# EAGLE design riffle-proto-grove-1.3 (EAGLE 7.5.0)
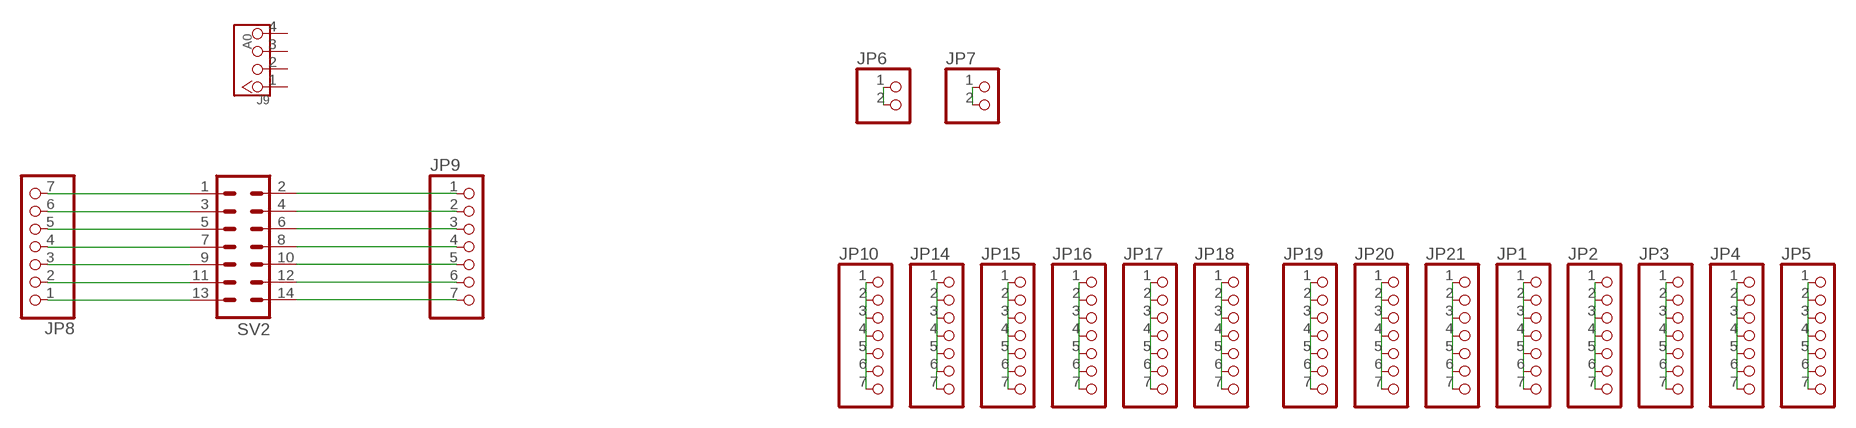
[diagram p0: schematic, sheet 1]

## Parts
J9  A0  TWIG-4P-2.0'90D'  [4P-2.0-90D]
JP1  HEADER-1X770MIL  [1X07_ROUND_70]
JP2  HEADER-1X770MIL  [1X07_ROUND_70]
JP3  HEADER-1X770MIL  [1X07_ROUND_70]
JP4  HEADER-1X770MIL  [1X07_ROUND_70]
JP5  HEADER-1X770MIL  [1X07_ROUND_70]
JP6  HEADER-1X2ROUND  [1X02_ROUND]
JP7  HEADER-1X2ROUND  [1X02_ROUND]
JP8  HEADER-1X770MIL  [1X07_ROUND_70]
JP9  HEADER-1X770MIL  [1X07_ROUND_70]
JP10  HEADER-1X770MIL  [1X07_ROUND_70]
JP14  HEADER-1X770MIL  [1X07_ROUND_70]
JP15  HEADER-1X770MIL  [1X07_ROUND_70]
JP16  HEADER-1X770MIL  [1X07_ROUND_70]
JP17  HEADER-1X770MIL  [1X07_ROUND_70]
JP18  HEADER-1X770MIL  [1X07_ROUND_70]
JP19  HEADER-1X770MIL  [1X07_ROUND_70]
JP20  HEADER-1X770MIL  [1X07_ROUND_70]
JP21  HEADER-1X770MIL  [1X07_ROUND_70]
SV2  MA07-2  [MA07-2]

## Nets
D3: JP9.5 SV2.10
GND: JP9.7 SV2.14
N$1: JP8.1 SV2.13
N$2: JP8.2 SV2.11
N$3: JP8.3 SV2.9
N$4: JP8.4 SV2.7
N$5: JP8.5 SV2.5
N$6: JP8.6 SV2.3
N$7: JP8.7 SV2.1
N$8: JP10.1 JP10.2 JP10.3 JP10.4 JP10.5 JP10.6 JP10.7
N$9: JP14.1 JP14.2 JP14.3 JP14.4 JP14.5 JP14.6 JP14.7
N$10: JP9.3 SV2.6
N$11: JP9.4 SV2.8
N$12: JP15.1 JP15.2 JP15.3 JP15.4 JP15.5 JP15.6 JP15.7
N$13: JP16.1 JP16.2 JP16.3 JP16.4 JP16.5 JP16.6 JP16.7
N$14: JP17.1 JP17.2 JP17.3 JP17.4 JP17.5 JP17.6 JP17.7
N$15: JP18.1 JP18.2 JP18.3 JP18.4 JP18.5 JP18.6 JP18.7
N$16: JP19.1 JP19.2 JP19.3 JP19.4 JP19.5 JP19.6 JP19.7
N$17: JP20.1 JP20.2 JP20.3 JP20.4 JP20.5 JP20.6 JP20.7
N$18: JP21.1 JP21.2 JP21.3 JP21.4 JP21.5 JP21.6 JP21.7
N$19: JP1.1 JP1.2 JP1.3 JP1.4 JP1.5 JP1.6 JP1.7
N$20: JP2.1 JP2.2 JP2.3 JP2.4 JP2.5 JP2.6 JP2.7
N$21: JP3.1 JP3.2 JP3.3 JP3.4 JP3.5 JP3.6 JP3.7
N$22: JP4.1 JP4.2 JP4.3 JP4.4 JP4.5 JP4.6 JP4.7
N$23: JP5.1 JP5.2 JP5.3 JP5.4 JP5.5 JP5.6 JP5.7
N$24: JP6.1 JP6.2
N$25: JP7.1 JP7.2
SCL: JP9.2 SV2.4
SDA: JP9.1 SV2.2
VCC: JP9.6 SV2.12
Unconnected: J9.1 J9.2 J9.3 J9.4

## Library data of the parts
J9 = Connector:TWIG-4P-2.0
JP1-JP5 JP8-JP10 JP14-JP21 = microbuilder:HEADER-1X7: PIN HEADER
JP6 JP7 = microbuilder:HEADER-1X2: PIN HEADER
SV2 = con-lstb:MA07-2: PIN HEADER; OC_FARNELL: unknown; OC_NEWARK: unknown

## Net classes
0 default: width 0.203 mm, drill 0.305 mm, clearance 0.152 mm

## Board
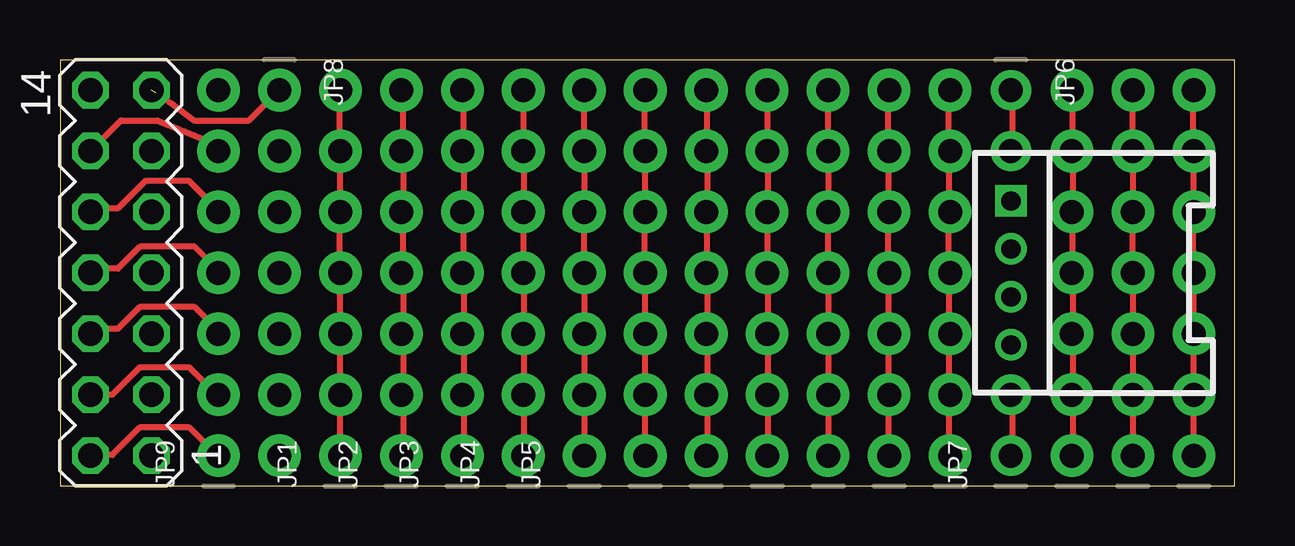
[diagram p1: board, top side]
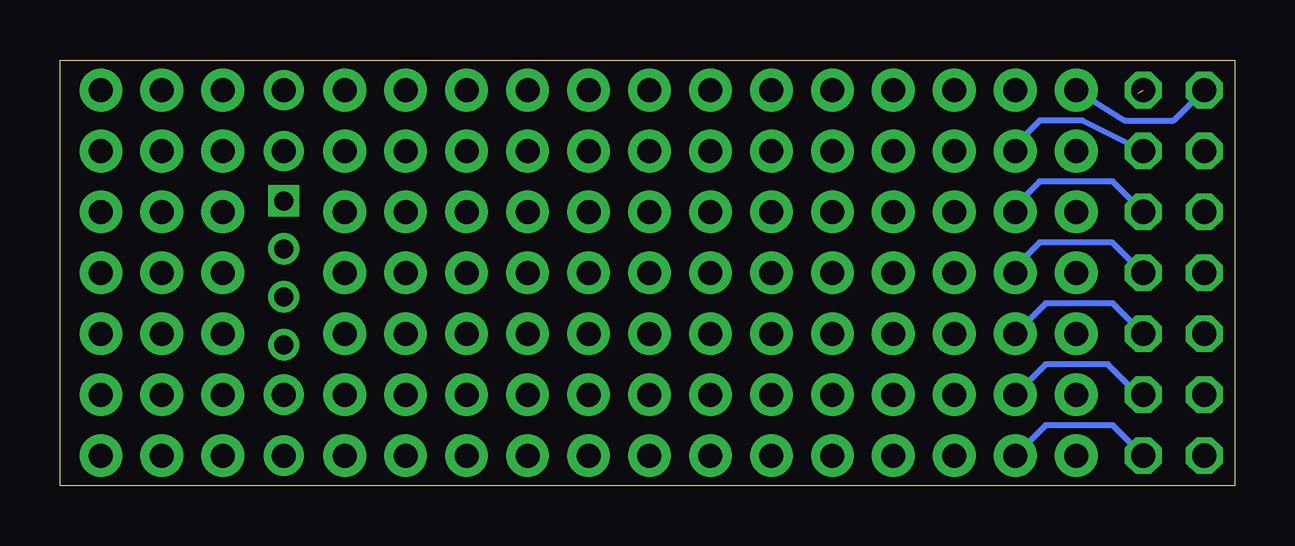
[diagram p2: board, bottom side, seen from below]

Size 48.95 x 17.77 mm. Coordinates in mm from the lower left corner, seen from the top.
Outline: 0,0 48.95,0 48.95,17.77 0,17.77 0,0
Copper layers (1*16): Top 0.035mm / dielectric 1.5mm / Bottom 0.035mm
Design rules "default": minimum track width 10mil, minimum drill 24mil, track to track 8mil, track to pad 8mil, pad to pad 8mil, via to via 8mil, smd to smd 8mil, copper to edge 40mil, drill to drill 8mil, minimum pad ring 10mil, minimum via ring 8mil, stop-mask expansion 4mil, vias tented up to drill 0mil, thermal gap 10mil

### Footprints (pad centres in the part's own frame; a part is rotated, then mirrored left to right if it is on the bottom)
4P-2.0-90D = drill 0.8 pad 1.27 square: 1 -3,0 | drill 0.8 pad 1.27: 2 -1,0; 3 1,0; 4 3,0
1X07_ROUND_70 = drill 1 pad 1.778: 1 -7.62,0; 2 -5.08,0; 3 -2.54,0; 4 0,0; 5 2.54,0; 6 5.08,0; 7 7.62,0
1X02_ROUND = drill 1 pad 1.676: 1 -1.27,0; 2 1.27,0
MA07-2 = drill 1.016 octagon: 1 -7.62,-1.27; 2 -7.62,1.27; 3 -5.08,-1.27; 4 -5.08,1.27; 5 -2.54,-1.27; 6 -2.54,1.27; 7 0,-1.27; 8 0,1.27; 9 2.54,-1.27; 10 2.54,1.27; 11 5.08,-1.27; 12 5.08,1.27; 13 7.62,-1.27; 14 7.62,1.27

### Placement (x,y rotation side)
J9  39.62,8.89 270 top
JP1  11.68,8.89 90 top
JP2  14.22,8.89 90 top
JP3  16.76,8.89 90 top
JP4  19.3,8.89 90 top
JP5  21.84,8.89 90 top
JP6  39.62,15.24 270 top
JP7  39.62,2.54 90 top
JP8  9.14,8.89 270 top
JP9  6.6,8.89 90 top
JP10  24.38,8.89 90 top
JP14  26.92,8.89 90 top
JP15  29.46,8.89 90 top
JP16  32,8.89 90 top
JP17  34.54,8.89 90 top
JP18  37.08,8.89 90 top
JP19  42.16,8.89 90 top
JP20  44.7,8.89 90 top
JP21  47.24,8.89 90 top
SV2  2.54,8.89 90 top

### Tracks (layer width: path | path; a pad name or v marks a point on that pad's centre or on a via)
D3
  Top 0.254: SV2.10 1.27,11.58 2.41,11.58 3.56,12.72 5.38,12.72 6.53,11.58 JP9.5
GND
  Bottom 0.254: SV2.14 2.54,15.24 4.57,15.24 JP9.7
N$1  (1 unrouted)
  Top 0.254: 9.04,16.38 JP8.1 7.87,15.24 5.59,15.24 4.57,16 4.14,16.26 4.01,16.38
N$2
  Bottom 0.254: SV2.11 6.35,15.24 8.13,15.24 9.14,14.22 JP8.2
N$3
  Bottom 0.254: SV2.9 5.08,12.7 8.13,12.7 9.14,11.68 JP8.3
N$4
  Bottom 0.254: SV2.7 4.01,9.07 5.11,10.16 8.13,10.16 9.14,9.14 JP8.4
N$5
  Bottom 0.254: SV2.5 5.08,7.62 7.87,7.62 JP8.5
N$6
  Bottom 0.254: SV2.3 4.01,3.81 5.28,5.08 7.87,5.08 JP8.6 9.04,3.81
N$7
  Bottom 0.254: SV2.1 5.08,2.54 7.87,2.54 JP8.7
N$8
  Top 0.254: JP10.7 24.36,16.38 24.36,14.1 JP10.6 24.36,13.87 24.36,11.58 JP10.5 24.36,11.35 24.36,9.07 JP10.4 24.36,8.84 24.36,6.55 JP10.3 24.36,6.32 24.36,3.81 | 24.36,3.81 24.36,1.29 JP10.1 | 24.36,3.81 JP10.2
N$9
  Top 0.254: JP14.7 26.98,16.26 26.98,13.97 JP14.6 26.98,13.87 26.98,11.58 JP14.5 26.98,11.35 26.98,9.07 JP14.4 26.98,8.84 26.98,6.55 JP14.3 26.98,6.2 26.98,3.68 | 26.98,3.68 26.98,1.29 JP14.1 | 26.98,3.68 JP14.2
N$10
  Top 0.254: SV2.6 1.27,6.55 2.41,6.55 3.33,7.47 5.61,7.47 6.53,6.55 JP9.3
N$11
  Top 0.254: SV2.8 1.27,9.07 2.41,9.07 3.33,9.98 5.61,9.98 6.6,8.99 JP9.4 6.53,9.07
N$12
  Top 0.254: JP15.7 29.49,16.38 29.49,14.1 JP15.6 29.49,13.87 29.49,11.58 JP15.5 29.49,11.35 29.49,9.07 JP15.4 29.49,8.84 29.49,6.55 JP15.3 29.49,6.32 29.49,3.81 | 29.49,3.81 29.49,1.29 JP15.1 | 29.49,3.81 JP15.2
N$13
  Top 0.254: JP16.5 32,13.84 JP16.7 | 32,13.99 JP16.6 | JP16.1 JP16.2 JP16.3 JP16.4 JP16.5 | 32,11.48 JP16.5
N$14
  Top 0.254: JP17.7 34.52,16.38 34.52,14.1 JP17.6 34.52,13.87 34.52,11.58 JP17.5 34.52,11.35 34.52,9.07 JP17.4 34.52,8.84 34.52,6.55 JP17.3 34.52,6.45 34.52,3.94 | 34.52,3.94 34.52,1.42 JP17.1 | 34.52,3.94 JP17.2
N$15
  Top 0.254: 37.03,11.48 37.03,13.74 JP18.6 37.03,14.1 37.03,16.38 JP18.7 | 37.03,11.46 JP18.5 37.03,11.48 | 37.03,3.81 37.03,1.29 JP18.1 | 37.03,3.81 37.03,6.32 JP18.3 37.03,6.55 37.03,8.84 JP18.4 37.03,9.2 37.03,11.46 | 37.03,3.81 JP18.2 | 37.03,11.46 37.03,11.48
N$16
  Top 0.254: JP19.7 42.19,16.38 42.19,14.1 JP19.6 42.19,13.87 42.19,11.58 JP19.5 42.19,11.35 42.19,9.07 JP19.4 42.19,8.84 42.19,6.55 JP19.3 42.19,6.32 42.19,3.81 | 42.19,3.81 42.19,1.29 JP19.1 | 42.19,3.81 JP19.2
N$17
  Top 0.254: JP20.7 JP20.6 JP20.5 JP20.4 JP20.3 JP20.2 JP20.1
N$18
  Top 0.254: JP21.7 47.22,16.38 47.22,14.1 JP21.6 47.22,13.87 47.22,11.58 JP21.5 47.22,11.35 47.22,9.07 JP21.4 47.22,8.84 47.22,6.55 JP21.3 47.22,6.32 47.22,3.81 | 47.22,3.81 47.22,1.29 JP21.1 | 47.22,3.81 JP21.2
N$19
  Top 0.254: JP1.7 11.66,16.51 11.66,14.22 JP1.6 11.66,13.87 11.66,11.58 JP1.5 11.66,11.35 11.66,9.07 JP1.4 11.66,8.84 11.66,6.55 JP1.3 11.66,6.32 11.66,3.68 | 11.66,3.68 11.66,1.29 JP1.1 | 11.66,3.68 JP1.2
N$20
  Top 0.254: JP2.7 14.3,16.38 14.3,14.1 JP2.6 14.3,13.87 14.3,11.58 JP2.5 14.3,11.35 14.3,9.07 JP2.4 14.3,8.84 14.3,6.55 JP2.3 14.3,6.32 14.3,3.81 | 14.3,3.81 14.3,1.29 JP2.1 | 14.3,3.81 JP2.2
N$21
  Top 0.254: JP3.7 16.82,16.38 16.82,14.1 JP3.6 16.82,13.87 16.82,11.58 JP3.5 16.82,11.35 16.82,9.07 JP3.4 16.82,8.84 16.82,6.55 JP3.3 16.82,6.32 16.82,3.81 | 16.82,3.81 16.82,1.29 JP3.1 | 16.82,3.81 JP3.2
N$22
  Top 0.254: JP4.7 19.33,16.38 19.33,14.1 JP4.6 19.33,13.87 19.33,11.58 JP4.5 19.33,11.35 19.33,9.07 JP4.4 19.33,8.84 19.33,6.55 JP4.3 19.33,6.32 19.33,3.81 | 19.33,3.81 19.33,1.29 JP4.1 | 19.33,3.81 JP4.2
N$23
  Top 0.254: JP5.7 JP5.6 JP5.5 JP5.4 JP5.3 JP5.2 JP5.1
N$24
  Top 0.254: JP6.2 39.67,14.1 39.67,16.38 JP6.1
N$25
  Top 0.254: JP7.1 39.67,1.29 39.67,3.81 JP7.2
SCL
  Top 0.254: SV2.4 2.18,3.81 3.33,4.95 5.38,4.95 6.53,3.81 JP9.2
SDA
  Top 0.254: SV2.2 1.27,1.29 2.18,1.29 3.33,2.44 5.38,2.44 6.53,1.29 JP9.1
VCC
  Top 0.254: SV2.12 2.54,15.24 4.06,15.24 6.6,14.22 JP9.6